# Altium schematic sheet PCF2123_RTC.schdoc
size A; DocumentNumber: 1; SheetNumber: 1; SheetTotal: 1
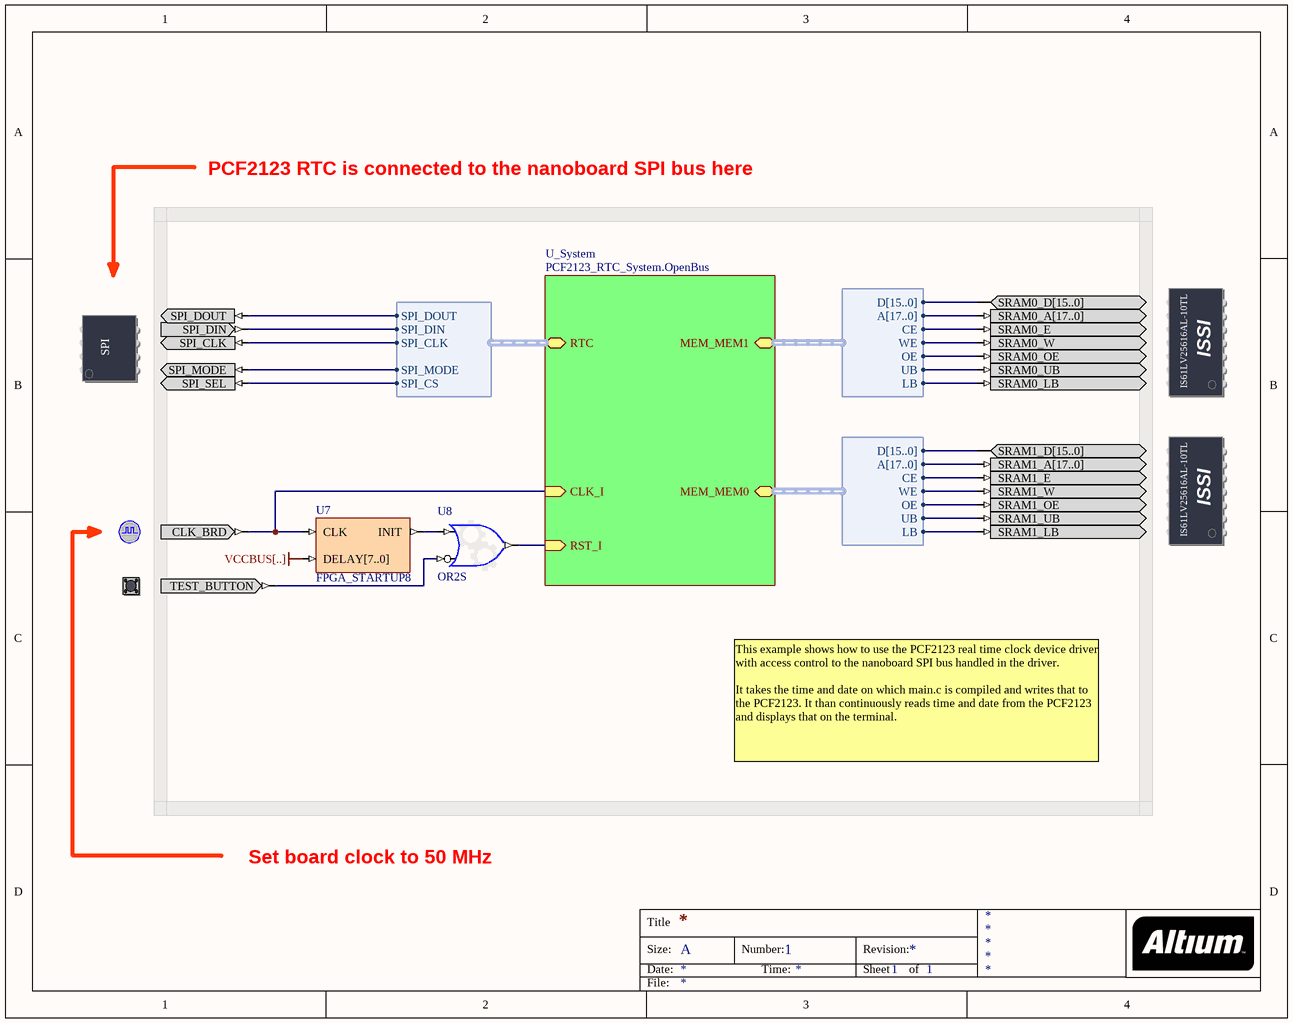
[diagram p0: PCF2123_RTC.schdoc]

## Parts
(Parts that share a designator on the sheet are numbered #1, #2 ... from top to bottom, then left to right.)
?#1  SRAM0  (value not drawn)
?#2  SERIALFMEMORY  (value not drawn)
?#3  SRAM1  (value not drawn)
?#4  CLOCK_BOARD  (value not drawn)
?#5  TEST_BUTTON  (value not drawn)
U7  FPGA_STARTUP8
U8  OR2S

## Sub-sheets
U_System = PCF2123_RTC_System.OpenBus: CLK_I (in), RST_I (in), MEM_MEM0 (harness WB_MEM_CTRL_SRAM16_A18), MEM_MEM1 (harness WB_MEM_CTRL_SRAM16_A18), RTC (harness SPI_W_NB)

## Harnesses
SPI_W_NB: SPI_DOUT, SPI_DIN, SPI_CLK, SPI_MODE, SPI_CS
WB_MEM_CTRL_SRAM16_A18: D[15..0], A[17..0], CE, WE, OE, UB, LB

## Nets
VCCBUS[..]: U7.DELAY[7..0]
Net?#1_SRAM0_A[17..0]: ?#1.SRAM0_A[17..0] ; sheet U_System/MEM_MEM1.A[17..0]
Net?#1_SRAM0_D[15..0]: ?#1.SRAM0_D[15..0] ; sheet U_System/MEM_MEM1.D[15..0]
Net?#1_SRAM0_E: ?#1.SRAM0_E ; sheet U_System/MEM_MEM1.CE
Net?#1_SRAM0_LB: ?#1.SRAM0_LB ; sheet U_System/MEM_MEM1.LB
Net?#1_SRAM0_OE: ?#1.SRAM0_OE ; sheet U_System/MEM_MEM1.OE
Net?#1_SRAM0_UB: ?#1.SRAM0_UB ; sheet U_System/MEM_MEM1.UB
Net?#1_SRAM0_W: ?#1.SRAM0_W ; sheet U_System/MEM_MEM1.WE
Net?#2_SPI_CLK: ?#2.SPI_CLK ; sheet U_System/RTC.SPI_CLK
Net?#2_SPI_DIN: ?#2.SPI_DIN ; sheet U_System/RTC.SPI_DIN
Net?#2_SPI_DOUT: ?#2.SPI_DOUT ; sheet U_System/RTC.SPI_DOUT
Net?#2_SPI_MODE: ?#2.SPI_MODE ; sheet U_System/RTC.SPI_MODE
Net?#2_SPI_SEL: ?#2.SPI_SEL ; sheet U_System/RTC.SPI_CS
Net?#3_SRAM1_A[17..0]: ?#3.SRAM1_A[17..0] ; sheet U_System/MEM_MEM0.A[17..0]
Net?#3_SRAM1_D[15..0]: ?#3.SRAM1_D[15..0] ; sheet U_System/MEM_MEM0.D[15..0]
Net?#3_SRAM1_E: ?#3.SRAM1_E ; sheet U_System/MEM_MEM0.CE
Net?#3_SRAM1_LB: ?#3.SRAM1_LB ; sheet U_System/MEM_MEM0.LB
Net?#3_SRAM1_OE: ?#3.SRAM1_OE ; sheet U_System/MEM_MEM0.OE
Net?#3_SRAM1_UB: ?#3.SRAM1_UB ; sheet U_System/MEM_MEM0.UB
Net?#3_SRAM1_W: ?#3.SRAM1_W ; sheet U_System/MEM_MEM0.WE
Net?#4_CLK_BRD: ?#4.CLK_BRD U7.CLK ; sheet U_System/CLK_I
Net?#5_TEST_BUTTON: ?#5.TEST_BUTTON U8.I1
NetU7_INIT: U7.INIT U8.I0
NetU8_O: U8.O ; sheet U_System/RST_I

## Notes on the sheet
- PCF2123 RTC is connected to the nanoboard SPI bus here
- This example shows how to use the PCF2123 real time clock device driver with access control to the nanoboard SPI bus handled in the driver.
  It takes the time and date on which main.c is compiled and writes that to the PCF2123. It than continuously reads time and date from the PCF2123 and displays that on the terminal.
- Set board clock to 50 MHz
- Title
- Size:
- Date:
- A
- Number:
- Time:
- Revision:
- Sheet
- of
- File:
- (in symbol SPI_BUS) SPI
- (in symbol SRAM0) ISSI; IS61LV25616AL-10TL
- (in symbol SRAM1) ISSI; IS61LV25616AL-10TL

## Library data of the parts
?#1 = SRAM0: Free Static RAM - Daughterboard; PortComponent: True; Published: 14-May-2007; Publisher: Altium Limited; HelpURL: https://wiki.altium.com/display/ADOH/NanoBoard+3000+-+Independent+SRAM
?#2 = SPI_BUS: Serial SPI Flash RAM; PortComponent: True; Published: 19-Nov-2003; Publisher: Altium Limited; HelpURL: https://wiki.altium.com/display/ADOH/Using+Multiple+SPI+and+I2C+Devices+in+a+Design; UseInDSF: True
?#3 = SRAM1: Free Static RAM - Daughterboard; PortComponent: True; Published: 14-May-2007; Publisher: Altium Limited; HelpURL: https://wiki.altium.com/display/ADOH/NanoBoard+3000+-+Independent+SRAM
?#4 = CLOCK_BOARD: Global System Clock Supply; PortComponent: True; Published: 19-Nov-2003; Publisher: Altium Limited; HelpURL: https://wiki.altium.com/display/ADOH/NanoBoard+3000+-+System+Clocks; UseInDSF: True
?#5 = TEST_BUTTON: Test / Reset Button; PortComponent: True; Published: 19-Nov-2003; Publisher: Altium Limited; HelpURL: https://wiki.altium.com/display/ADOH/NanoBoard+3000+-+Test-Reset+Button
U7 = FPGA_STARTUP8: FPGA Startup With 8 Bit Delay; Published: 9-Dec-2004; Publisher: Altium Limited; HelpURL: CR0119 FPGA_STARTUPx Powerup Delay Unit.pdf; LastRevisionNo: 1.00.00; ComponentLink1Description: Core &Resource Usage; ComponentLink1URL: CR0139 FPGA Peripheral Resource Usage.pdf#page=11
U8 = GATE: Configurable Generic Gate; ConfiguratorName: GENERIC_GATE; ConfigurationParameters: {}Version[1.0]{}GateKind[OR]{}BusInput[False]{}GateInputType[Bit]{}GateOutputOption[Normal]{}BusWidth[8]{}RegisterOutputs[False]{}NegativeClockEdge[False]{}InputCount[2]{}InputInvert0[False]{}InputInvert1[True]{}; LastRevisionNo: 1.00.00; Published: 3-Sep-2008; Publisher: Altium Limited